# EAGLE design MainBoard 1.3.4 (EAGLE 9.4.2)
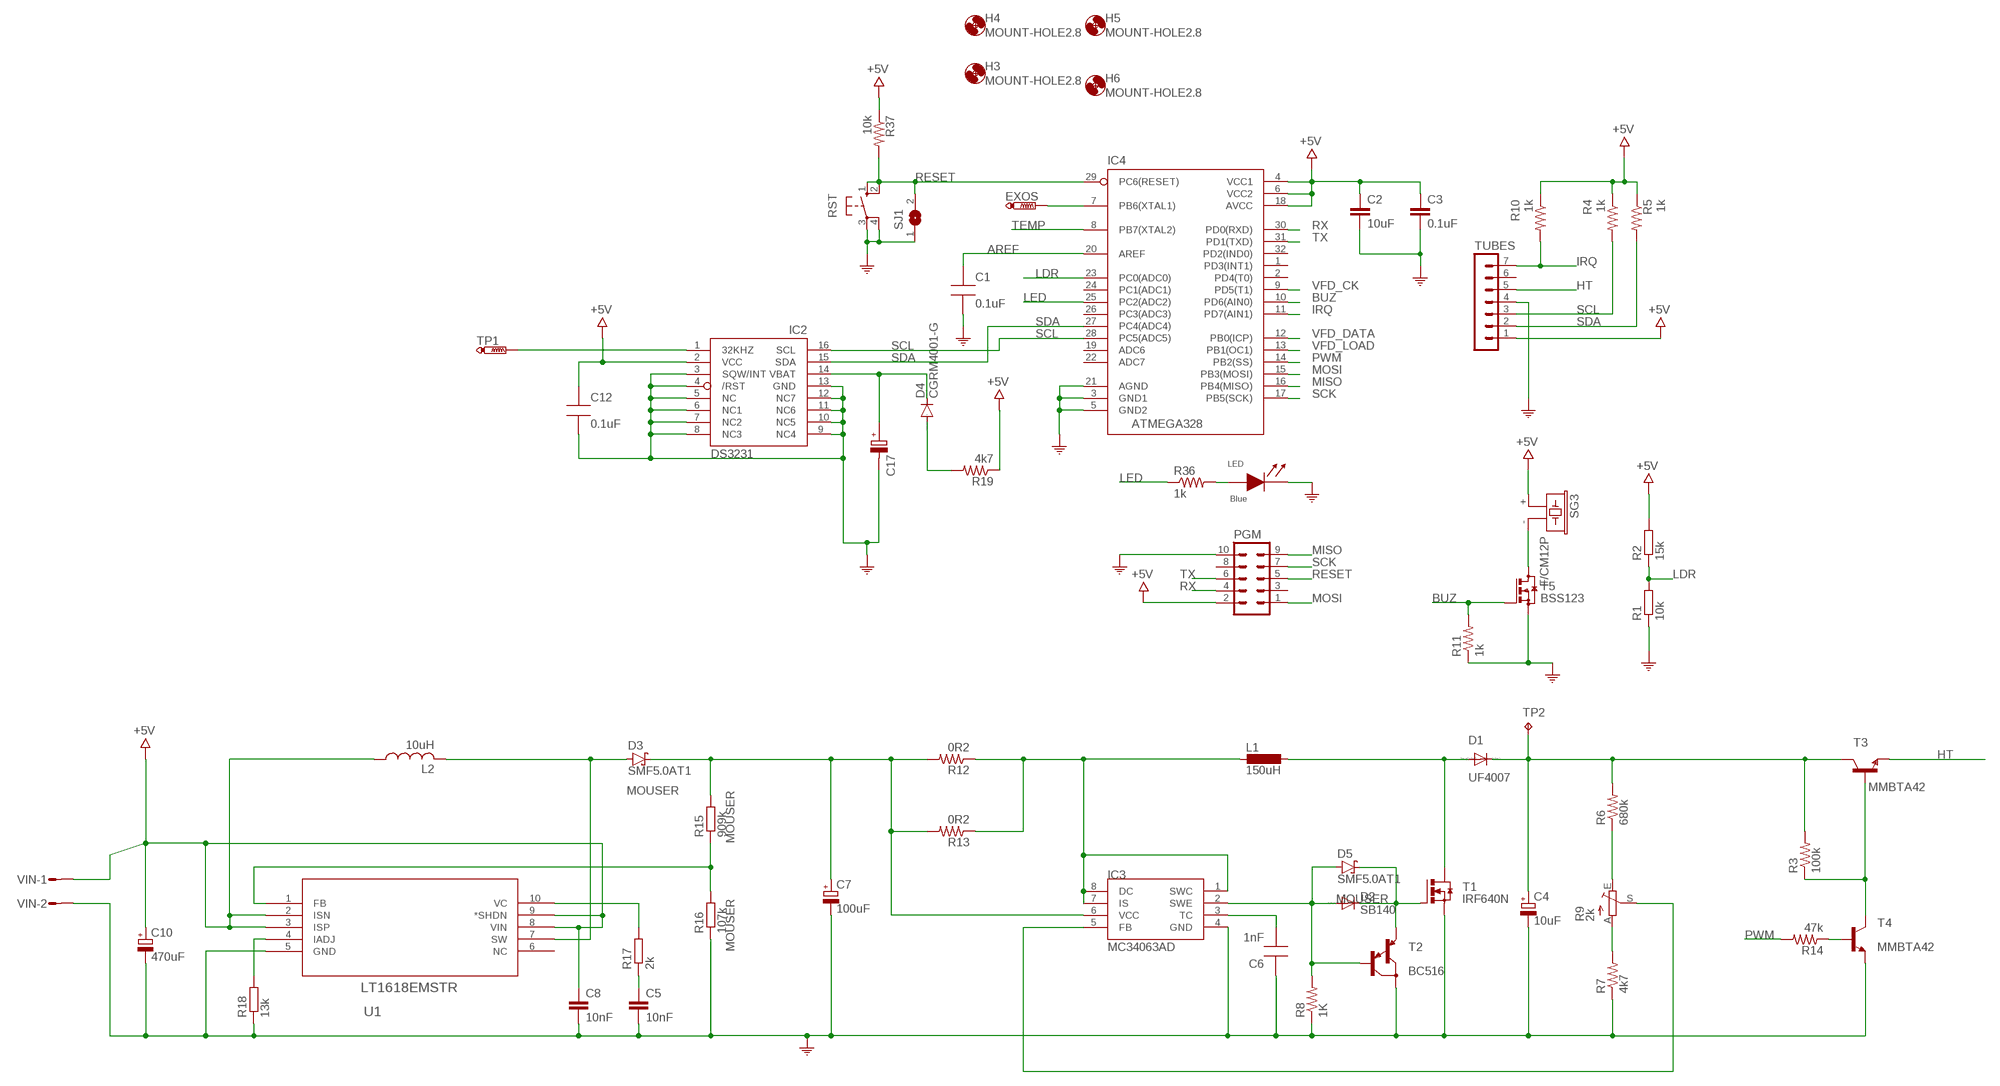
[diagram p0: schematic, sheet 1]

## Parts
C1  0.1uF  CAP0805-NP  [CAP0805-NP]
C2  10uF  C-EUC0603  [C0603]
C3  0.1uF  C-EUC0402K  [C0402K]
C4  10uF  CPOL-EUE3.5-10  [E3,5-10]
C5  10nF  C-EUC0805  [C0805]
C6  1nF  CAP0805-NP  [CAP0805-NP]
C7  100uF  CPOL-EUE2,5-6E  [E2,5-6E]
C8  10nF  C-EUC0805  [C0805]
C10  470uF  CPOL-EU153CLV-0810  [153CLV-0810]
C12  0.1uF  CAP0805-NP  [CAP0805-NP]
C17  AHG-35/100-RADIAL  [ELNA21.5X8.0]
D1  UF4007  BYT01  [F126-10]
D2  SB140  DIODE-DO07  [DO07]
D3  SMF5.0AT1  [SOD123FL]
D4  CGRM4001-G  [SOD-123_MINI-SMA]
D5  SMF5.0AT1  [SOD123FL]
EXOS  PTR1TP09R  [TP09R]
H3  MOUNT-HOLE2.8  [2,8]
H4  MOUNT-HOLE2.8  [2,8]
H5  MOUNT-HOLE2.8  [2,8]
H6  MOUNT-HOLE2.8  [2,8]
IC2  DS3231/SO  [SO16W]
IC3  MC34063AD  [SOIC8]
IC4  ATMEGA328  ATMEGA168-20AU  [QFP032]
L1  150uH  DO3316P  [DO3316P]
L2  10uH  L-USL5650M  [L5650M]
LED  Blue  LED0805  [LED0805]
PGM  MA05-2  [MA05-2]
R1  10k  R-EU_M2012  [M2012]
R2  15k  R-EU_0204/2V  [0204V]
R3  100k  R-US_R2012  [R2012]
R4  1k  R-US_M2012  [M2012]
R5  1k  R-US_M2012  [M2012]
R6  680k  R-US_R2012  [R2012]
R7  4k7  R-US_R2012  [R2012]
R8  1K  R-US_R2012  [R2012]
R9  2k  TRIM_EU-B25P  [B25P]
R10  1k  R-US_M2012  [M2012]
R11  1k  R-US_M2012  [M2012]
R12  0R2  R-US_R2010  [R2010]
R13  0R2  R-US_R2010  [R2010]
R14  47k  R-US_R2012  [R2012]
R15  909k  R-EU_R0805  [R0805]
R16  107k  R-EU_R0805  [R0805]
R17  2k  R-EU_R0805  [R0805]
R18  13k  R-EU_R0805  [R0805]
R19  4k7  R-US_M2012  [M2012]
R36  1k  R-US_M2012  [M2012]
R37  10k  R-US_M2012  [M2012]
RST  10-XX  [B3F-10XX]
SG3  F/CM12P  [F/CM12P]
SJ1  SJW  [SJW]
T1  IRF640N  IRF3704S  [D2PACK]
T2  BC516  [TO92]
T3  MMBTA42  BC846  [SOT23]
T4  MMBTA42  BC846  [SOT23]
T5  BSS123  [SOT23]
TP1  PTR1TP09R  [TP09R]
TP2  TPTP12R  [TP12R]
TUBES  MA07-1  [MA07-1]
U1  LT1618EMSTR  [MSOP-10_MS]
VIN  M02S  [02P]

## Nets
+5V [pwr]: C2.1 C3.1 C8.1 C10.+ C12.1 IC2.2(VCC) IC4.4(VCC1) IC4.6(VCC2) IC4.18(AVCC) L2.1 PGM.2 R2.2 R4.1 R5.1 R10.1 R19.1 R37.1 SG3.+ TUBES.1 U1.2(ISN) U1.3(ISP) U1.8(VIN) U1.9(*SHDN) VIN.1
AREF: C1.1 IC4.20(AREF)
BATT: C17.+ D4.C IC2.14(VBAT)
BUZ: IC4.10(PD6(AIN0)) R11.2 T5.1(G)
GND: C1.2 C2.2 C3.2 C4.- C5.2 C6.1 C7.- C8.2 C10.- C12.2 C17.- IC2.3(SQW/INT) IC2.4(/RST) IC2.5(NC) IC2.6(NC1) IC2.7(NC2) IC2.8(NC3) IC2.9(NC4) IC2.10(NC5) IC2.11(NC6) IC2.12(NC7) IC2.13(GND) IC3.4(GND) IC4.3(GND1) IC4.5(GND2) IC4.21(AGND) LED.1(CA) PGM.10 R1.1 R7.1 R8.1 R11.1 R16.1 R18.1 RST.3(P) RST.4(P1) SJ1.1 T1.3(S) T2.3(C) T4.2(E) T5.2(S) TUBES.4 U1.5(GND) VIN.2 ; supply symbol labelled COM
HT: T3.2(E) TUBES.5
IRQ: IC4.11(PD7(AIN1)) R10.2 TUBES.7
LDR: IC4.23(PC0(ADC0)) R1.2 R2.1
LED: IC4.25(PC2(ADC2)) R36.1
MISO: IC4.16(PB4(MISO)) PGM.9
MOSI: IC4.15(PB3(MOSI)) PGM.1
N$1: IC2.1(32KHZ) TP1.TP
N$2: D1.A L1.2 T1.2(D)
N$3: SG3.- T5.3(D)
N$5: EXOS.TP IC4.7(PB6(XTAL1))
N$6: C6.2 IC3.3(TC)
N$7: R3.1 T3.1(B) T4.3(C)
N$9: R7.2 R9.A
N$10: D2.A D5.A IC3.2(SWE) R8.2 T2.2(B)
N$11: R6.1 R9.E
N$12: D3.A L2.2 U1.7(SW)
N$14: R18.2 U1.4(IADJ)
N$15: LED.2(AN) R36.2
N$16: IC3.5(FB) R9.S
N$17: IC3.1(SWC) IC3.7(IS) IC3.8(DC) L1.1 R12.1 R13.1
N$18: R17.2 U1.10(VC)
N$19: R14.1 T4.1(B)
N$21: D2.C D5.C T1.1(G) T2.1(E)
N$22: C5.1 R17.1
N$23: D4.A R19.2
N$24: R15.1 R16.2 U1.1(FB)
PWM: IC4.14(PB2(SS)) R14.2
PWR [pwr]: C7.+ D3.C IC3.6(VCC) R12.2 R13.2 R15.2
RAW_HT: C4.+ D1.C R3.2 R6.2 T3.3(C) TP2.TP
RESET: IC4.29(PC6(RESET)) PGM.5 R37.2 RST.1(S) RST.2(S1) SJ1.2
RX: IC4.30(PD0(RXD)) PGM.4
SCK: IC4.17(PB5(SCK)) PGM.7
SCL: IC2.16(SCL) IC4.28(PC5(ADC5)) R4.2 TUBES.3
SDA: IC2.15(SDA) IC4.27(PC4(ADC4)) R5.2 TUBES.2
TEMP: IC4.8(PB7(XTAL2))
TX: IC4.31(PD1(TXD)) PGM.6
VFD_CK: IC4.9(PD5(T1))
VFD_DATA: IC4.12(PB0(ICP))
VFD_LOAD: IC4.13(PB1(OC1))
Unconnected: IC4.1(PD3(INT1)) IC4.2(PD4(T0)) IC4.19(ADC6) IC4.22(ADC7) IC4.24(PC1(ADC1)) IC4.26(PC3(ADC3)) IC4.32(PD2(IND0)) PGM.3 PGM.8 TUBES.6 U1.6(NC)

## Library data of the parts
C1 C6 C12 = MySMD:CAP0805-NP
C2 = rcl:C-EU: CAPACITOR, European symbol; MOUSER: 791-0603X106K100CT; SPICEPREFIX: C
C3 = rcl:C-EU: CAPACITOR, European symbol; MOUSER: 963-JMK042BJ104KC-W; SPICEPREFIX: C
C4 = resistor:CPOL-EU: POLARIZED CAPACITOR, European symbol
C5 C8 = resistor:C-EU: CAPACITOR, European symbol
C7 = rcl:CPOL-EU: POLARIZED CAPACITOR, European symbol; SPICEPREFIX: C
C10 = rcl:CPOL-EU: POLARIZED CAPACITOR, European symbol; MOUSER: 710-865080253012; SPICEPREFIX: C
C17 = Elkos:AHG-35/100-RADIAL: AUDYN® - AHG Gepolt, radial High Grade AHG Gepolter Elekrolytkondensator für Audio-Netzteile, oder Verstärker im Home- und Car-Bereich. Technische Daten Anschlußdrähte: Kupfer, verzinnt AL: ? mm d2ø : ? mm Kapazitätsbereich: von 10 µF bis 2200 µF Nennspannungen: 25 V, 35 V, 50 V, 100 V C-Toleranz: 20 % ( bei 20° C ) Verlustfaktor: tan δ < 0,100 @ 1 kHz Temperaturbereich: - 40° C bis 85° C Verzerrung: sehr gering bei 10 kHz, 010 A - 120 dB oder niedriger gepolt AHG AUDYN® - AHG gepolt Bezeichnung C U DxH Rm Bestell.-Nr. U / Volt D x L/mm mm AHG/10.0/100V 10µF 100V 10x15 5,0 1341690 AHG/22.0/50V 22µF 50V 10x13 5,0 1341691 AHG/47.0/50V 47µF 50V 10x16 5,0 1341692 AHG/100.0/50V 100µF 50V 13x21 5,0 1341693 AHG/220.0/50V 220µF 50V 16x25 7,5 1341694 AHG/470.0/50V 470µF 50V 16x37 7,5 1341695 AHG/1000/35V 1000µF 35V 18x37 7,5 1341696 AHG/2200/35V 2200µF 35V 22x38 10,0 1341697 Alle Abmessungen in mm; MOUSER: 555-DB-5R5D474T
D1 = diode:BYT01: DIODE ultra fast
D2 = diode:DIODE-: DIODE
D3 D5 = diode:SMF5.0AT1: 200 W Transient Voltage Suppressor Source: Data sheet <http://www.onsemi.com/pub_link/Collateral/SMF5.0AT1-D.PDF>; MOUSER: 863-MBR0520LT1G
D4 = diode:CGRM400*-G: Molded plasitc,JEDEC SOD-123/Mini SMA Source: Comchip CGRM4001-G.pdf; MOUSER: 863-NSR0320MW2T1G
EXOS TP1 = testpad:PTR1: TEST PIN
H3-H6 = holes:MOUNT-HOLE: MOUNTING HOLE with drill center marker
IC2 = DS3231:DS3231: The DS3231 is a low-cost, extremely accurate I²C real-time clock (RTC) with an integrated temperature-compensated crystal oscillator (TCXO) and crystal. The device incorporates a battery input, and maintains accurate timekeeping when main power to the device is interrupted.; AVAILABILITY: Unavailable; MF: Maxim Integrated; MP: DS3231; PACKAGE: SOIC-16 Maxim Integrated; PRICE: None
IC3 = mc34063:MC34063
IC4 = MySMD:ATMEGA168-20AU
L1 = inductor-coilcraft:DO3316P: COILCRAFT; OC_FARNELL: unknown; OC_NEWARK: unknown
L2 = rcl:L-US: INDUCTOR, American symbol; MOUSER: 851-CR43NP-100MC; SPICEPREFIX: L
LED = MySMD:LED0805
PGM = con-lstb:MA05-2: PIN HEADER; OC_FARNELL: unknown; OC_NEWARK: unknown
R1 R2 R17 R18 = resistor:R-EU_: RESISTOR, European symbol
R3-R8 R10-R14 R19 R36 R37 = adafruit:R-US_: RESISTOR, American symbol
R9 = pot:TRIM_EU-: POTENTIOMETER
R15 = resistor:R-EU_: RESISTOR, European symbol; MOUSER: 754-RR1220P-9093D-M
R16 = resistor:R-EU_: RESISTOR, European symbol; MOUSER: RR0816P-1073-D-04D
RST = switch-omron:10-XX: OMRON SWITCH; MPN: B3F-1000; OC_FARNELL: 176432; OC_NEWARK: 36M3542
SG3 = buzzer:F/CM12P: BUZZER Source: Buerklin; OC_FARNELL: unknown; OC_NEWARK: unknown
SJ1 = jumper:SJ: SMD solder JUMPER
T1 = transistor-power:IRF3704: SMPS MOSFET HEXFET® Power MOSFET Source: http://www.irf.com/product-info/datasheets/data/irf3704.pdf
T2 = transistor-pnp:BC516: PNP Darlington Transistor
T3 T4 = transistor:BC846: NPN TRANSISTOR
T5 = transistor-small-signal:BSS123: N-CHANNEL MOS FET
TP2 = testpad:TP: Test pad
TUBES = con-lstb:MA07-1: PIN HEADER; OC_FARNELL: unknown; OC_NEWARK: unknown
U1 = LT1618EMSTR:LT1618EMSTR; AVAILABILITY: Unavailable; DESCRIPTION: LT1618 - Constant-Current/Constant-Voltage 1.4MHz Step-Up DC/DC Converter; MF: Linear Technology; MOUSER: 584-LT1618EMS#PBF; MP: LT1618EMS#TR; PACKAGE: MSOP-10 Linear Technology; PRICE: None
VIN = con-amp-quick:M02S: AMP QUICK CONNECTOR; OC_FARNELL: unknown; OC_NEWARK: unknown

## Module TUBEIN16
Ports: 

### Library data of the parts

## Net classes
0 default: width 0.254 mm, clearance 0.254 mm
1 pwr: width 0.254 mm, clearance 0.356 mm

## Board
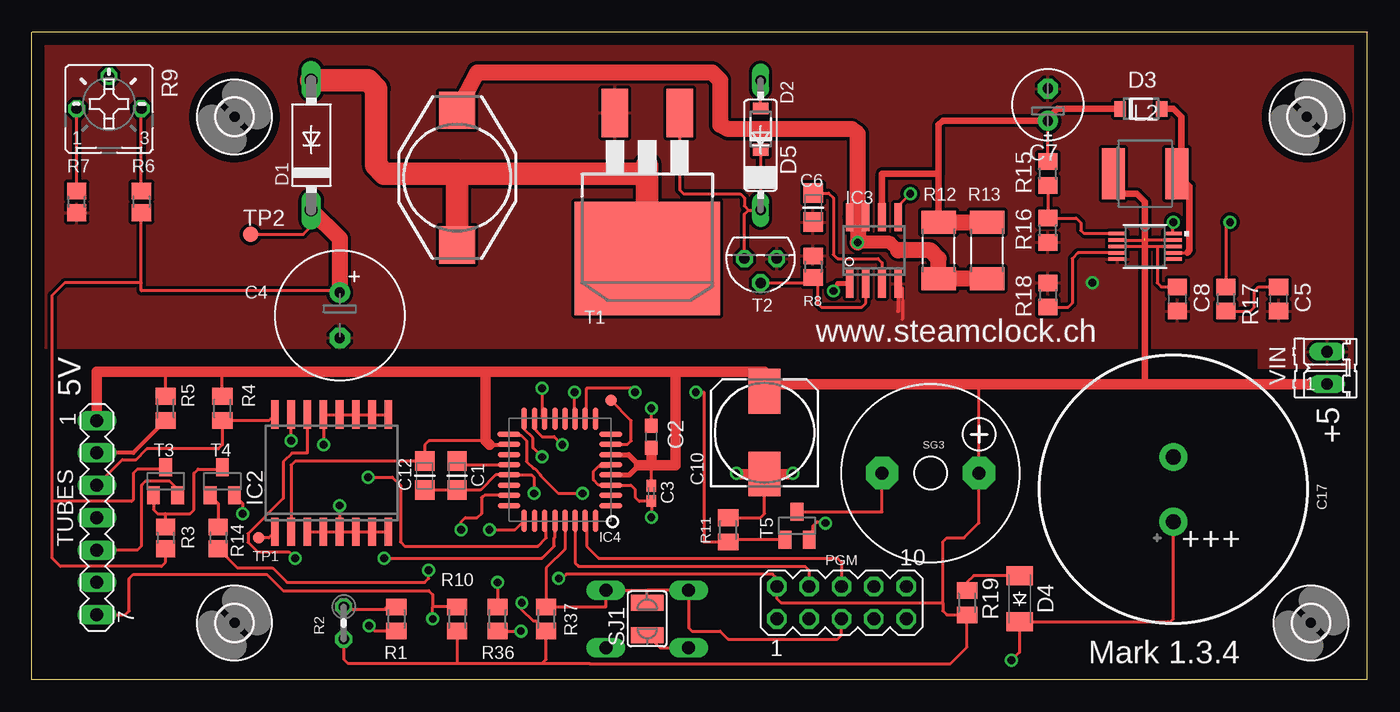
[diagram p1: board, top side]
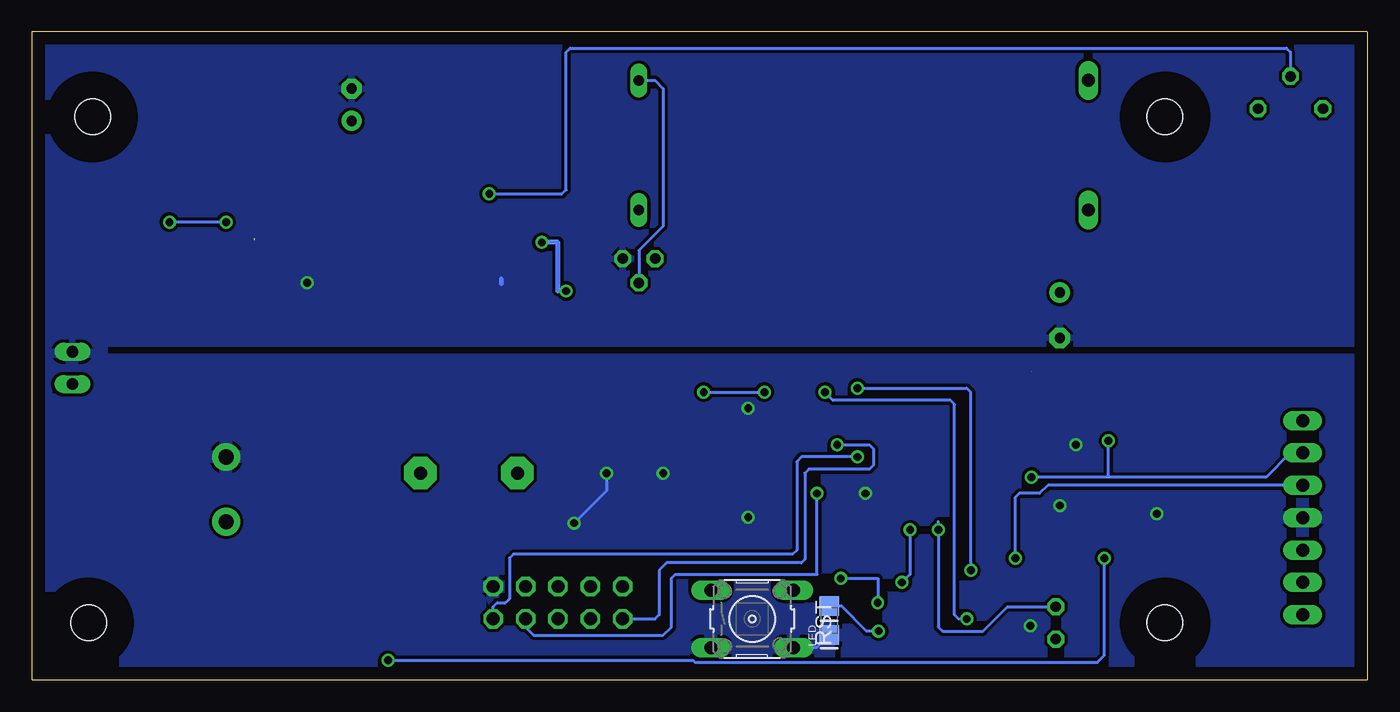
[diagram p2: board, bottom side, seen from below]

Size 104.8 x 50.81 mm. Coordinates in mm from the lower left corner, seen from the top.
Outline: 104.77,0.01 104.77,50.8
Outline: 104.77,0 0.02,0
Outline: 0,0.01 0,50.8
Outline: 0.02,50.81 104.8,50.81
Copper layers (1*16): Top 0.035mm / dielectric 1.5mm / Bottom 0.035mm
Design rules "default": minimum track width 10mil, minimum drill 24mil, track to track 8mil, track to pad 8mil, pad to pad 8mil, via to via 8mil, smd to smd 8mil, copper to edge 40mil, drill to drill 8mil, minimum pad ring 10mil, minimum via ring 8mil, stop-mask expansion 4mil, vias tented up to drill 0mil, thermal gap 10mil

### Footprints (pad centres in the part's own frame; a part is rotated, then mirrored left to right if it is on the bottom)
CAP0805-NP = smd 1.524 x 1.524: 1 0,0; 2 2.286,0
C0603 = smd 1.1 x 1: 1 -0.85,0; 2 0.85,0
C0402K = smd 0.925 x 0.74: 1 -0.6,0; 2 0.6,0
E3,5-10 = drill 0.813 pad 1.6: + -1.778,0 | drill 0.813 pad 1.6 octagon: - 1.778,0
C0805 = smd 1.3 x 1.5: 1 -0.95,0; 2 0.95,0
E2,5-6E = drill 0.813 pad 1.575: + -1.27,0 | drill 0.813 pad 1.575 octagon: - 1.27,0
153CLV-0810 = smd 3.5 x 2.5: + 3.25,0; - -3.25,0
ELNA21.5X8.0 = drill 1.2 pad 2.184: + -2.54,0; - 2.54,0
F126-10 = drill 1.016 long: A 5.08,0; C -5.08,0
DO07 = drill 0.813 long: A 5.08,0; C -5.08,0
SOD123FL = smd 0.91 x 1.22: A 1.625,0; C -1.625,0
SOD-123_MINI-SMA = smd 1.5 x 2.1: A 1.8,0; C -1.8,0
TP09R = smd 0.9 x 0.9: TP 0,0
2,8 = hole 2.8: 0,0
SO16W = smd 0.6 x 2.2: 1 -4.445,-4.6; 2 -3.175,-4.6; 3 -1.905,-4.6; 4 -0.635,-4.6; 5 0.635,-4.6; 6 1.905,-4.6; 7 3.175,-4.6; 8 4.445,-4.6; 9 4.445,4.6; 10 3.175,4.6; 11 1.905,4.6; 12 0.635,4.6; 13 -0.635,4.6; 14 -1.905,4.6; 15 -3.175,4.6; 16 -4.445,4.6
SOIC8 = smd 0.6 x 2.2: 1 -1.905,-2.6; 2 -0.635,-2.6; 3 0.635,-2.6; 4 1.905,-2.6; 5 1.905,2.6; 6 0.635,2.6; 7 -0.635,2.6; 8 -1.905,2.6
QFP032 = smd 0.432 x 1.778: 1 0,0; 2 0.8,0; 3 1.599,0; 4 2.399,0; 5 3.199,0; 6 3.998,0; 7 4.798,0; 8 5.598,0; 17 5.588,8.001; 18 4.798,7.997; 19 3.998,7.997; 20 3.199,7.997; 21 2.399,7.997; 22 1.599,7.997; 23 0.799,7.997; 24 0,7.997 | smd 1.778 x 0.432: 9 6.807,1.194; 10 6.807,2.007; 11 6.807,2.794; 12 6.807,3.607; 13 6.807,4.394; 14 6.807,5.182; 15 6.807,5.994; 16 6.816,6.803; 25 -1.194,6.807; 26 -1.194,5.994; 27 -1.194,5.182; 28 -1.194,4.394; 29 -1.194,3.607; 30 -1.194,2.794; 31 -1.194,2.007; 32 -1.194,1.194
DO3316P = smd 2.92 x 2.79: 1 -5.28,0; 2 5.28,0
L5650M = smd 1.8 x 4: 1 -2.5,0; 2 2.5,0
LED0805 = smd 1.524 x 1.524: 1 0,0; 2 2.286,0
MA05-2 = drill 1.016 octagon: 1 -5.08,-1.27; 2 -5.08,1.27; 3 -2.54,-1.27; 4 -2.54,1.27; 5 0,-1.27; 6 0,1.27; 7 2.54,-1.27; 8 2.54,1.27; 9 5.08,-1.27; 10 5.08,1.27
M2012 = smd 1.3 x 1.6: 1 -0.95,0; 2 0.95,0
0204V = drill 0.813 octagon: 1 -1.27,0; 2 1.27,0
R2012 = smd 1.3 x 1.5: 1 -0.85,0; 2 0.85,0
B25P = drill 0.813 octagon: A -2.54,0; E 2.54,0; S 0,2.54
R2010 = smd 1.8 x 2.7: 1 -2.2,0; 2 2.2,0
R0805 = smd 1.3 x 1.5: 1 -0.95,0; 2 0.95,0
B3F-10XX = drill 1.016 long: 1 -3.251,2.261; 2 3.251,2.261; 3 -3.251,-2.261; 4 3.251,-2.261
F/CM12P = drill 1.016 pad 2.54 octagon: + 3.81,0; - -3.81,0
SJW = smd 1.27 x 2.54: 1 -1.27,0; 2 1.27,0
D2PACK = smd 2.083 x 3.81: 1 -2.54,-8.89; 3 2.54,-8.89 | smd 11.43 x 8.89: 2 0,2.54
TO92 = drill 0.813 octagon: 1 1.27,0; 2 0,1.905; 3 -1.27,0
SOT23 = smd 1 x 1.4: 1 -0.95,-1.1; 2 0.95,-1.1; 3 0,1.1
TP12R = smd 1.2 x 1.2: TP 0,0
MA07-1 = drill 1.016 long: 1 -7.62,0; 2 -5.08,0; 3 -2.54,0; 4 0,0; 5 2.54,0; 6 5.08,0; 7 7.62,0
MSOP-10_MS = smd 1.397 x 0.279: 1 -2.184,1.001; 2 -2.184,0.5; 3 -2.184,0; 4 -2.184,-0.5; 5 -2.184,-1.001; 6 2.184,-1.001; 7 2.184,-0.5; 8 2.184,0; 9 2.184,0.5; 10 2.184,1.001
02P = drill 0.914 long: 1 -1.27,0; 2 1.27,0

### Placement (x,y rotation side)
C1  33.36,17.16 270 top
C2  48.6,19.06 90 top
C3  48.6,14.62 270 top
C4  24.15,28.59 270 top
C5  97.81,29.86 270 top
C6  61.3,35.89 90 top
C7  79.71,45.1 90 top
C8  89.87,29.86 270 top
C10  57.49,19.38 90 top
C12  30.82,17.16 270 top
C17  89.55,14.94 90 top
D1  21.93,41.92 90 top
D2  57.17,41.92 90 top
D3  87.02,44.78 0 top
D4  77.49,6.36 90 top
D5  57.17,43.19 90 top
EXOS  45.42,21.92 0 top
H3  15.89,44.15 0 top
H4  15.89,4.46 0 top
H5  100.35,4.46 0 top
H6  100.03,44.15 0 top
IC2  23.52,16.2 0 top
IC3  66.06,33.67 0 top
IC4  45.42,13.67 90 top
L1  33.36,39.38 270 top
L2  87.33,39.7 0 top
LED  42.25,3.5 90 bottom
PGM  63.52,6.04 0 top
R1  28.59,4.78 90 top
R2  24.47,4.46 270 top
R3  10.5,11.12 270 top
R4  14.94,21.28 270 top
R5  10.5,21.28 270 top
R6  8.59,37.48 270 top
R7  3.51,37.48 90 top
R8  61.3,32.4 270 top
R9  6.05,44.78 0 top
R10  33.36,4.78 90 top
R11  54.63,11.76 270 top
R12  71.14,33.67 90 top
R13  74.95,33.67 90 top
R14  14.62,11.12 270 top
R15  79.71,39.7 90 top
R16  79.71,35.26 90 top
R17  93.68,29.86 90 top
R18  79.71,30.18 270 top
R19  73.36,6.04 90 top
R36  36.53,4.78 270 top
R37  40.34,4.78 90 top
RST  48.28,4.78 0 bottom
SG3  70.5,16.2 0 top
SJ1  48.28,4.78 90 top
T1  48.28,35.57 180 top
T2  57.17,33.03 180 top
T3  10.5,15.57 0 top
T4  14.94,15.57 0 top
T5  60.03,12.08 0 top
TP1  17.8,11.12 180 top
TP2  17.16,34.94 0 top
TUBES  5.1,12.71 270 top
U1  87.33,33.98 0 top
VIN  101.62,24.46 90 top

### Tracks (layer width: path | path; a pad name or v marks a point on that pad's centre or on a via)
+5V  (via drill 0.61)  (2 unrouted)
  Top 0.254: 37.39,18.43 IC4.18 | C10.+ 57.49,23.19 57.49,24.14 | 74.31,23.19 SG3.+ 74.31,12.32 73.12,11.12 71.77,11.12 71.46,10.81 71.46,6.05 | 40.03,1.28 40.34,1.6 R37.1 39.58,4.59 39.34,4.59 38.44,5.5 v38.44,6.05 | R5.1 10.5,24.14 | R4.1 14.94,24.14 | 33.36,1.28 24.79,1.28 24.47,1.6 R2.2 | 33.36,1.28 40.03,1.28 | R10.1 33.36,1.28 | 71.46,6.05 71.46,5.41 71.77,5.09 71.78,5.09 R19.1 73.36,2.55 72.08,1.27 43.75,1.27 43.74,1.28 40.03,1.28 | 71.46,6.05 58.76,6.05 58.44,6.36 PGM.2 58.44,7.95 58.11,8.28 41.94,8.28 41.61,7.95 v41.33,7.95 | 26.37,24.14 | U1.3 87.33,33.98 88.28,33.98 | 88.28,33.98 U1.8 | C3.1 48.6,16.84 | U1.9 87.33,34.49 U1.2 | 35.58,18.74 31.13,18.74 30.82,18.43 C12.1 20.66,17.16 20.34,16.84 IC2.2 | 88.28,33.98 88.28,31.13 88.6,30.81 C8.1
  Top 0.305: 45.14,17.63 IC4.6 | 10.5,22.55 R5.1 | 35.9,18.43 37.39,18.43
  Top 0.406: IC4.6 46.82,17.66 47.65,16.84 46.87,16.06 IC4.4
  Top 0.508: 87.33,23.19 87.33,33.98 87.33,34.49 | 87.33,34.62 87.33,37.48 86.7,38.11 85.43,38.11 84.83,38.71 L2.1 84.83,41.25
  Top 0.813: 14.94,24.14 10.5,24.14 5.1,24.14 TUBES.1 | 14.94,24.14 26.37,24.14 | 26.37,24.14 35.58,24.14 | VIN.1 87.33,23.19 74.31,23.19 57.49,23.19 | 57.49,24.14 50.5,24.14 | 50.5,24.14 35.58,24.14 | 47.65,16.84 48.6,16.84 | 48.6,16.84 50.5,16.84 50.5,24.14 | 35.58,24.14 35.58,18.74 35.9,18.43 | 48.6,16.84 C2.1
  Bottom 0.254: v41.33,7.95 38.44,7.95 v38.44,6.05
AREF
  Top 0.254: C1.1 33.36,16.84 37.4,16.84
  Top 0.305: 37.4,16.84 IC4.20
BATT  (via drill 0.61)
  Top 0.254: C17.+ 89.55,4.78 89.24,4.46 89.13,4.56 D4.C 77.49,2.16 v76.85,1.52 | IC2.14 21.61,17.79 21.59,17.77 20.41,17.77 19.73,17.09 19.73,14.23 16.97,11.47 16.97,10.78 17.73,10.02 20.17,10.02 v20.66,9.54
  Bottom 0.254: v76.85,1.52 52.92,1.52 52.77,1.37 21.2,1.37 20.66,1.92 v20.66,9.54
BUZ  (via drill 0.61)
  Top 0.254: T5.1 54.8,10.98 R11.2 52.73,10.81 52.73,22.55 v52.09,22.55 | IC4.10 43.52,20.57 43.52,22.87 47.01,22.87 v47.33,22.55
  Bottom 0.254: v52.09,22.55 v47.33,22.55
GND  (via drill 0.61)
  Top 0.254: IC4.21 37.94,16.06 | C1.2 33.04,15.19 | IC4.21 39.21,16.06 39.39,15.89 v39.39,14.62 | v83.2,31.13 83.29,31.13 | T4.2 | 60.81,10.81 T5.2 61.3,11.3 61.3,12.08 61.62,12.4 62.25,12.4 v62.25,12.29 | IC4.21 36.39,16.06 35.2,14.87 C1.2 | T4.2 16.38,13.98 | R1.1 26.88,3.82 v26.47,4.23 | SJ1.1 49.27,2.51 RST.3 | R11.1 57.17,12.71 57.49,13.03 C10.- | 45.4,16.84 45.4,16.82 45.35,16.76 44.46,16.76 44.05,16.35 44.05,15.67 44.46,15.26 IC4.3 47,15.26 47.33,14.94 47.33,14.3 47.65,13.98 48.56,13.98 C3.2 v48.6,12.75 | C2.2 v48.6,21.28 | IC3.4 68.28,30.75 68.28,28.27 | C1.2 C12.2 | IC2.9 IC2.10 IC2.11 IC2.12 IC2.13 v22.88,18.43 | IC2.3 IC2.4 IC2.5 | IC2.5 IC2.6 IC2.7 IC2.8 | v24.15,13.67 IC2.5 | T4.2 16.53,13.83 v16.53,13.03 | VIN.2 101.62,25.59
  Top 0.305: 45.4,16.84 IC4.5 | IC3.4 67.96,28.9
  Top 0.813: C10.- 57.88,16.52 57.49,16.52 | C10.- 59.64,16.13 v59.71,16.21 | C10.- 55.34,16.13 v55.27,16.21
  Bottom 0.254: 62.25,12.4 v62.25,12.29 59.71,14.83 v59.71,16.21 | LED.1 43.24,2.51 RST.4
  Bottom 0.406: 67.96,31.44 IC3.4
  pour Bottom: -0.6,25.09 -0.89,-2.42 106.27,-0.63 105.99,25.09
  pour Top: 0.02,50.81 0.02,26.05 104.8,26.05 104.8,50.81
  pour Top: 105.43,27.32 96.22,27.32 96.22,24.46 105.43,24.46
  pour Bottom: 105.43,26.37 -0.61,26.37 -0.61,51.13 105.43,51.13
  pour Bottom: 106.06,27.63 106.06,22.55 99.08,22.55 99.08,27.63
HT
  Top 0.254: T3.2 11.45,14.94 10.81,15.57 8.91,15.57 8.67,15.33 8.59,15.25 8.59,10.49 8.28,10.17 TUBES.5
IRQ  (via drill 0.61)
  Top 0.254: IC4.11 42.57,20.54 v42.57,22.55 | TUBES.7 7.32,5.09 7.64,5.41 7.64,7.95 7.96,8.27 18.43,8.27 19.7,7 31.13,7 31.45,6.68 31.45,5.73 | R10.2 31.45,5.72 31.45,5.73 | v31.45,4.78 31.45,5.73
  Bottom 0.254: v31.45,4.78 32.09,4.78 32.41,5.09 32.41,21.6 32.72,21.92 41.93,21.92 v42.57,22.55
LDR  (via drill 0.61)
  Top 0.254: IC4.23 35.51,14.46 35.41,14.36 35.33,14.36 35.26,14.3 35.26,13.03 34.95,12.71 33.99,12.71 33.68,12.4 v33.68,11.76 | 28.28,6.04 R1.2 27.83,5.72 27.64,5.54 | R2.1 24.66,5.54 27.64,5.54 | 27.64,5.54 28.59,5.54
  Bottom 0.254: R2.1 28.28,5.73 30.18,3.82 33.36,3.82 33.68,4.14 v33.68,11.76 33.68,12.4
LED  (via drill 0.61)
  Top 0.254: v36.53,7.63 R36.1 | v35.9,11.76 37.9,11.76 IC4.25
  Bottom 0.254: v36.53,7.63 35.9,8.27 v35.9,11.76
MISO  (via drill 0.61)
  Top 0.254: v40.03,17.47 39.3,18.19 39.3,18.96 38.62,19.65 IC4.16
  Bottom 0.254: v40.03,17.47 44.41,17.47 44.79,17.09 44.79,10.17 45.11,9.85 67.01,9.85 67.33,9.54 67.33,6.36 67.65,6.05 68.28,6.05 68.6,5.73 PGM.9
MOSI  (via drill 0.61)
  Top 0.254: IC4.15 39.43,19.67 39.58,19.52 39.58,19.51 40.03,19.06 40.98,19.06 v41.61,18.43
  Bottom 0.254: PGM.1 55.9,4.78 55.58,5.09 55.58,8.58 54.99,9.18 44.43,9.18 44.15,9.45 44.15,16.21 43.84,16.52 39.07,16.52 38.76,16.84 38.76,18.11 39.07,18.43 v41.61,18.43
N$1
  Top 0.254: IC2.1 18.59,11.12 TP1.TP
N$2
  Top 1.778: L1.2 33.36,39.7 | 33.36,39.7 27.64,39.7 27.01,40.33 27.01,46.37 26.37,47 D1.A | 33.36,39.7 47.96,39.7 48.28,40.33 T1.2
N$3
  Top 0.254: T5.3 66.69,13.18 SG3.-
N$5
  Top 0.254: IC4.7 46.73,18.46 47.01,18.74 47.01,20.33 EXOS.TP
N$6
  Top 0.254: C6.2 62.5,38.18 62.89,37.8 62.89,33.35 63.2,33.03 66.38,33.03 66.69,32.72 IC3.3
N$7
  Top 0.254: T4.3 14.94,16.52 13.04,16.52 12.72,16.21 12.72,13.35 12.4,13.03 10.5,13.03 | T3.1 9.55,13.35 9.86,13.03 10.5,13.03 | R3.1 10.5,13.03
N$9
  Top 0.254: R7.2 R9.A
N$10
  Top 0.254: T2.2 60.88,31.13 R8.2 61.62,31.23 61.62,29.54 61.93,29.22 65.11,29.22 65.42,29.54 IC3.2 | D5.A D2.A
  Bottom 0.254: D2.A 55.9,47 55.27,46.37 55.27,35.57 57.17,33.67 T2.2
N$11
  Top 0.254: R6.1 R9.E
N$12
  Top 0.254: 90.83,33.67 90.64,33.48 U1.7
  Top 0.508: 90.67,33.51 90.83,33.67 90.83,38.71 L2.2 90.19,40.06 90.19,44.15 89.55,44.78 D3.A
N$14
  Top 0.254: 80.03,28.9 R18.2 81.3,29.22 81.62,29.54 81.62,33.03 82.07,33.48 U1.4
N$15  (via drill 0.61)
  Top 0.254: R36.2 v38.36,3.82
  Bottom 0.254: LED.2 41.3,5.79 39.33,3.82 v38.36,3.82
N$16  (via drill 0.6)
  Top 0.254: IC3.5 67.96,37.16 v68.92,38.11
  Bottom 0.254: v68.92,38.11 63.2,38.11 62.89,38.43 62.89,49.22 62.57,49.54 6.37,49.54 6.05,49.22 R9.S
N$17  (via drill 0.6)
  Top 0.254: IC3.8 IC3.7 64.79,35.63 64.79,35.57
  Top 0.406: IC3.1 63.2,31.07 v62.89,30.49
  Top 0.61: IC3.8 64.79,36.52
  Top 1.016: 64.79,36.52 64.79,37.48 | 67.96,33.67 67.33,34.3 v64.79,34.3
  Top 1.27: 64.79,37.48 64.79,42.81 64.31,43.19 54.63,43.19 54,43.51 54,47 53.36,47.64 34.95,47.64 L1.1 | 67.96,33.67 70.5,33.67 71.14,33.03 R12.1 R13.1 | 64.79,35.57 v64.79,34.3
  Bottom 0.406: v62.89,30.49 63.52,30.49 63.52,34.3 v64.79,34.3
N$18  (via drill 0.61)
  Top 0.254: U1.10 89.52,35.85 v89.55,35.89 | v94,35.89 93.68,35.57 R17.2
  Bottom 0.254: v89.55,35.89 v94,35.89
N$19
  Top 0.254: T4.1 14.62,13.84 R14.1
N$21
  Top 0.254: T2.1 55.9,36.52 56.22,36.84 | 56.22,36.84 D2.C D5.C | T1.1 50.82,38.43 51.14,38.11 55.58,38.11 55.9,37.8 55.9,37.16 56.22,36.84
N$22
  Top 0.254: R17.1 95.59,28.91 95.91,29.22 95.91,30.49 96.22,30.81 C5.1
N$23
  Top 0.254: D4.A 73.89,8.16 73.36,7.63 R19.2
N$24
  Top 0.254: R15.1 R16.2 81.94,36.21 82.29,35.85 82.29,35.26 82.56,34.99 U1.1
PWM  (via drill 0.61)
  Top 0.254: v40.03,22.87 40.03,20.69 IC4.14 | 15.36,9.54 R14.2 16.12,8.78 18.88,8.78 20.02,7.63 30.82,7.63 31.13,7.95 v31.13,8.58
  Bottom 0.254: v31.13,8.58 31.13,22.55 31.45,22.87 v40.03,22.87
PWR  (1 unrouted)
  Top 0.254: C7.+ R15.2
  Top 0.508: IC3.6 66.69,39.7 71.14,39.7 | R12.2 71.14,39.7 | D3.C 80.46,44.78 79.71,44.03 C7.+ 71.46,43.83 71.14,43.51 71.14,39.7
  Top 1.27: 71.14,35.89 R12.2 R13.2
RAW_HT
  Top 0.254: C4.+ 24.13,30.49 8.59,30.49 8.59,31.13 | 8.59,31.13 R6.2 | 8.59,31.13 2.56,31.13 1.61,30.18 1.61,13.98 | 1.61,13.98 7.81,13.98 7.96,14.13 7.96,16.21 8.28,16.52 10.35,16.52 T3.3 | R3.2 10.5,9.22 10.18,8.9 2.24,8.9 1.61,9.54 1.61,13.98 | TP2.TP 21.29,34.94 21.93,35.57 D1.C
  Top 1.27: D1.C 24.15,34.62 C4.+
RESET
  Top 0.254: IC4.29 41.82,10.25 40.34,8.78 R37.2 45.03,5.72 RST.2 48.28,7.04 | PGM.5 63.52,3.5 63.2,3.19 54.63,3.19 54,3.82 51.77,3.82 51.53,4.06 RST.1 48.28,7.04 | SJ1.2 48.28,7.04
RX
  Top 0.254: IC4.30 42.63,9.16 42.88,8.9 60.66,8.9 60.98,8.58 PGM.4
SCK  (via drill 0.61)
  Top 0.254: IC4.17 37.51,19.16 38.39,19.16 38.8,18.75 38.8,17.12 39.34,16.57 39.42,16.57 39.9,16.1 39.9,16.01 41.3,14.62 v43.2,14.62
  Bottom 0.254: v43.2,14.62 43.2,8.27 54.31,8.27 54.63,7.95 54.63,4.14 55.27,3.5 65.42,3.5 66.06,4.14 PGM.7
SCL  (via drill 0.61)
  Top 0.254: TUBES.3 7.11,17.26 8.18,17.26 9.03,18.11 14.62,18.11 14.94,18.43 R4.2 18.6,20.33 IC2.16 | v27.64,9.54 40.03,9.54 40.98,10.49 40.98,11.12 41.03,11.18 IC4.28
  Bottom 0.254: TUBES.3 25.1,15.25 25.74,14.62 27.32,14.62 27.64,14.3 v27.64,9.54
SDA  (via drill 0.61)
  Top 0.254: IC4.27 40.34,12.37 40.34,11.12 39.71,10.49 29.23,10.49 28.91,10.81 28.91,15.25 28.28,15.89 v26.37,15.89 | v20.34,18.74 IC2.15
  Top 0.305: R5.2 7.95,17.79 TUBES.2
  Bottom 0.254: TUBES.2 6.05,17.79 7.96,15.89 20.34,15.89 | 20.34,15.89 v26.37,15.89 | 20.34,15.89 v20.34,18.74
TX
  Top 0.254: IC4.31 43.52,12.37 43.52,10.49 44.47,9.54 63.2,9.54 63.52,9.22 PGM.6

### Text on the board
tNames: www.steamclock.ch | 5V | 5 | + | + | + | + | Mark 1.3.4